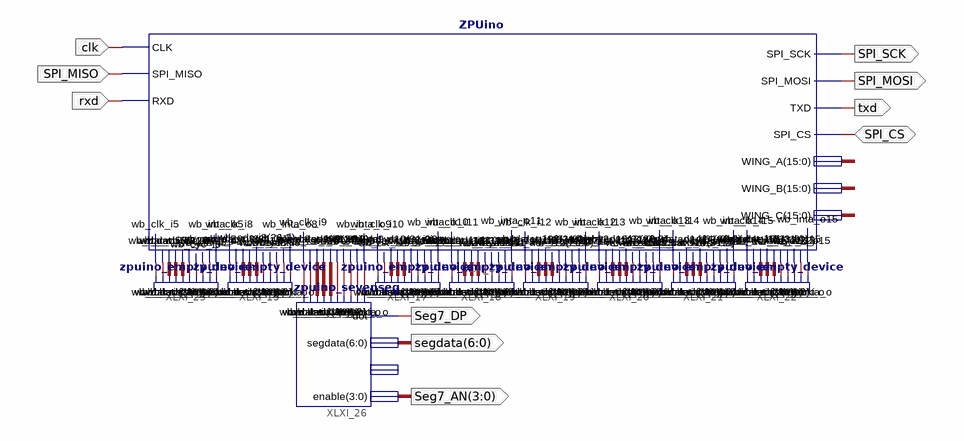
[diagram p0: schematic sheet 1]
// Xilinx ISE schematic Papilio_SOC_Base.sch (spartan3e) as structural Verilog: 10 symbols, 10 ports
module Papilio_SOC_Base (
  input  clk,
  input  SPI_MISO,
  input  rxd,
  inout  SPI_CS,
  output SPI_SCK,
  output SPI_MOSI,
  output txd,
  output Seg7_DP,
  output [6:0] segdata,
  output [3:0] Seg7_AN
);

  wire XLXN_11, XLXN_12, XLXN_16, XLXN_17, XLXN_18, XLXN_19, XLXN_20, XLXN_39, XLXN_40, XLXN_44, XLXN_45,
       XLXN_46, XLXN_47, XLXN_48, XLXN_49, XLXN_50, XLXN_54, XLXN_55, XLXN_56, XLXN_57, XLXN_58, XLXN_59,
       XLXN_60, XLXN_64, XLXN_65, XLXN_66, XLXN_67, XLXN_68, XLXN_69, XLXN_70, XLXN_74, XLXN_75, XLXN_76,
       XLXN_77, XLXN_78, XLXN_79, XLXN_80, XLXN_84, XLXN_85, XLXN_86, XLXN_87, XLXN_88, XLXN_89, XLXN_90,
       XLXN_94, XLXN_95, XLXN_96, XLXN_97, XLXN_98, XLXN_99, XLXN_100, XLXN_104, XLXN_105, XLXN_106,
       XLXN_107, XLXN_108, XLXN_121, XLXN_122, XLXN_126, XLXN_127, XLXN_128, XLXN_129, XLXN_130;
  wire [15:0] WING_A, WING_B, WING_C;
  wire [26:2] XLXN_15, XLXN_43, XLXN_53, XLXN_63, XLXN_73, XLXN_83, XLXN_93, XLXN_103, XLXN_125;
  wire [31:0] XLXN_13, XLXN_14, XLXN_41, XLXN_42, XLXN_51, XLXN_52, XLXN_61, XLXN_62, XLXN_71, XLXN_72,
       XLXN_81, XLXN_82, XLXN_91, XLXN_92, XLXN_101, XLXN_102, XLXN_123, XLXN_124;

  ZPUino XLXI_12 (
    .CLK(clk), .SPI_MISO(SPI_MISO), .RXD(rxd), .wb_clk_i5(XLXN_121), .wb_rst_i5(XLXN_122),
    .wb_dat_o5(XLXN_123), .wb_dat_i5(XLXN_124), .wb_adr_i5(XLXN_125), .wb_we_i5(XLXN_126),
    .wb_cyc_i5(XLXN_127), .wb_stb_i5(XLXN_128), .wb_ack_o5(XLXN_129), .wb_inta_o5(XLXN_130),
    .wb_clk_i8(XLXN_11), .wb_rst_i8(XLXN_12), .wb_dat_o8(XLXN_13), .wb_dat_i8(XLXN_14), .wb_adr_i8(XLXN_15),
    .wb_we_i8(XLXN_16), .wb_cyc_i8(XLXN_17), .wb_stb_i8(XLXN_18), .wb_ack_o8(XLXN_19), .wb_inta_o8(XLXN_20),
    .wb_clk_i9(XLXN_39), .wb_rst_i9(XLXN_40), .wb_dat_o9(XLXN_41), .wb_dat_i9(XLXN_42), .wb_adr_i9(XLXN_43),
    .wb_we_i9(XLXN_44), .wb_cyc_i9(XLXN_45), .wb_stb_i9(XLXN_46), .wb_ack_o9(XLXN_47), .wb_inta_o9(XLXN_48),
    .wb_clk_i10(XLXN_49), .wb_rst_i10(XLXN_50), .wb_dat_o10(XLXN_51), .wb_dat_i10(XLXN_52),
    .wb_adr_i10(XLXN_53), .wb_we_i10(XLXN_54), .wb_cyc_i10(XLXN_55), .wb_stb_i10(XLXN_56),
    .wb_ack_o10(XLXN_57), .wb_inta_o10(XLXN_58), .wb_clk_i11(XLXN_59), .wb_rst_i11(XLXN_60),
    .wb_dat_o11(XLXN_61), .wb_dat_i11(XLXN_62), .wb_adr_i11(XLXN_63), .wb_we_i11(XLXN_64),
    .wb_cyc_i11(XLXN_65), .wb_stb_i11(XLXN_66), .wb_ack_o11(XLXN_67), .wb_inta_o11(XLXN_68),
    .wb_clk_i12(XLXN_69), .wb_rst_i12(XLXN_70), .wb_dat_o12(XLXN_71), .wb_dat_i12(XLXN_72),
    .wb_adr_i12(XLXN_73), .wb_we_i12(XLXN_74), .wb_cyc_i12(XLXN_75), .wb_stb_i12(XLXN_76),
    .wb_ack_o12(XLXN_77), .wb_inta_o12(XLXN_78), .wb_clk_i13(XLXN_79), .wb_rst_i13(XLXN_80),
    .wb_dat_o13(XLXN_81), .wb_dat_i13(XLXN_82), .wb_adr_i13(XLXN_83), .wb_we_i13(XLXN_84),
    .wb_cyc_i13(XLXN_85), .wb_stb_i13(XLXN_86), .wb_ack_o13(XLXN_87), .wb_inta_o13(XLXN_88),
    .wb_clk_i14(XLXN_89), .wb_rst_i14(XLXN_90), .wb_dat_o14(XLXN_91), .wb_dat_i14(XLXN_92),
    .wb_adr_i14(XLXN_93), .wb_we_i14(XLXN_94), .wb_cyc_i14(XLXN_95), .wb_stb_i14(XLXN_96),
    .wb_ack_o14(XLXN_97), .wb_inta_o14(XLXN_98), .wb_clk_i15(XLXN_99), .wb_rst_i15(XLXN_100),
    .wb_dat_o15(XLXN_101), .wb_dat_i15(XLXN_102), .wb_adr_i15(XLXN_103), .wb_we_i15(XLXN_104),
    .wb_cyc_i15(XLXN_105), .wb_stb_i15(XLXN_106), .wb_ack_o15(XLXN_107), .wb_inta_o15(XLXN_108),
    .SPI_SCK(SPI_SCK), .SPI_MOSI(SPI_MOSI), .TXD(txd), .SPI_CS(SPI_CS), .WING_A(WING_A), .WING_B(WING_B),
    .WING_C(WING_C));
  zpuino_empty_device XLXI_15 (
    .wb_clk_i(XLXN_11), .wb_rst_i(XLXN_12), .wb_dat_o(XLXN_13), .wb_dat_i(XLXN_14), .wb_adr_i(XLXN_15),
    .wb_we_i(XLXN_16), .wb_cyc_i(XLXN_17), .wb_stb_i(XLXN_18), .wb_ack_o(XLXN_19), .wb_inta_o(XLXN_20));
  zpuino_empty_device XLXI_17 (
    .wb_clk_i(XLXN_49), .wb_rst_i(XLXN_50), .wb_dat_o(XLXN_51), .wb_dat_i(XLXN_52), .wb_adr_i(XLXN_53),
    .wb_we_i(XLXN_54), .wb_cyc_i(XLXN_55), .wb_stb_i(XLXN_56), .wb_ack_o(XLXN_57), .wb_inta_o(XLXN_58));
  zpuino_empty_device XLXI_18 (
    .wb_clk_i(XLXN_59), .wb_rst_i(XLXN_60), .wb_dat_o(XLXN_61), .wb_dat_i(XLXN_62), .wb_adr_i(XLXN_63),
    .wb_we_i(XLXN_64), .wb_cyc_i(XLXN_65), .wb_stb_i(XLXN_66), .wb_ack_o(XLXN_67), .wb_inta_o(XLXN_68));
  zpuino_empty_device XLXI_19 (
    .wb_clk_i(XLXN_69), .wb_rst_i(XLXN_70), .wb_dat_o(XLXN_71), .wb_dat_i(XLXN_72), .wb_adr_i(XLXN_73),
    .wb_we_i(XLXN_74), .wb_cyc_i(XLXN_75), .wb_stb_i(XLXN_76), .wb_ack_o(XLXN_77), .wb_inta_o(XLXN_78));
  zpuino_empty_device XLXI_20 (
    .wb_clk_i(XLXN_79), .wb_rst_i(XLXN_80), .wb_dat_o(XLXN_81), .wb_dat_i(XLXN_82), .wb_adr_i(XLXN_83),
    .wb_we_i(XLXN_84), .wb_cyc_i(XLXN_85), .wb_stb_i(XLXN_86), .wb_ack_o(XLXN_87), .wb_inta_o(XLXN_88));
  zpuino_empty_device XLXI_21 (
    .wb_clk_i(XLXN_89), .wb_rst_i(XLXN_90), .wb_dat_o(XLXN_91), .wb_dat_i(XLXN_92), .wb_adr_i(XLXN_93),
    .wb_we_i(XLXN_94), .wb_cyc_i(XLXN_95), .wb_stb_i(XLXN_96), .wb_ack_o(XLXN_97), .wb_inta_o(XLXN_98));
  zpuino_empty_device XLXI_22 (
    .wb_clk_i(XLXN_99), .wb_rst_i(XLXN_100), .wb_dat_o(XLXN_101), .wb_dat_i(XLXN_102), .wb_adr_i(XLXN_103),
    .wb_we_i(XLXN_104), .wb_cyc_i(XLXN_105), .wb_stb_i(XLXN_106), .wb_ack_o(XLXN_107), .wb_inta_o(XLXN_108));
  zpuino_empty_device XLXI_23 (
    .wb_clk_i(XLXN_121), .wb_rst_i(XLXN_122), .wb_dat_o(XLXN_123), .wb_dat_i(XLXN_124), .wb_adr_i(XLXN_125),
    .wb_we_i(XLXN_126), .wb_cyc_i(XLXN_127), .wb_stb_i(XLXN_128), .wb_ack_o(XLXN_129), .wb_inta_o(XLXN_130));
  zpuino_sevenseg XLXI_26 (
    .wb_clk_i(XLXN_39), .wb_rst_i(XLXN_40), .wb_dat_o(XLXN_41), .wb_dat_i(XLXN_42), .wb_adr_i(XLXN_43),
    .wb_we_i(XLXN_44), .wb_cyc_i(XLXN_45), .wb_stb_i(XLXN_46), .wb_ack_o(XLXN_47), .wb_inta_o(XLXN_48),
    .dot(Seg7_DP), .segdata(segdata), .enable(Seg7_AN));  // open: extra
endmodule
